# Altium schematic sheet EFUSE_TPS259460A.SchDoc
size A3
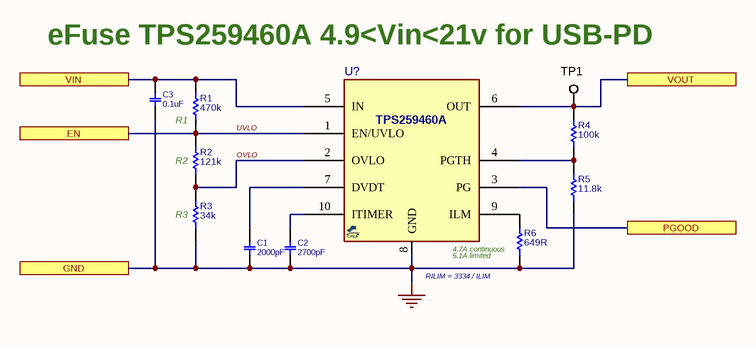
[diagram p0: EFUSE_TPS259460A.SchDoc]

## Parts
C1  2000pF  [C0402]
C2  2700pF  [C0402]
C3  0.1uF  [C0402]
R1  470k  [R0402]
R2  121k  [R0402]
R3  34k  [R0402]
R4  100k  [R0402]
R5  11.8k  [R0402]
R6  649R  [R0402]
TP1  TESTPOINT_SMD  [TPSMD_S1]  (value not drawn)  (no BOM)
U?  TPS259460A  [QFN45_10_2020_RPW]  (value not drawn)

## Ports
EN, GND, PGOOD, VIN, VOUT

## Nets
GND: C1.1 C2.1 C3.1 R3.1 R5.1 R6.1 U?.8(GND) ; port GND
OVLO: R2.1 R3.2 U?.2(OVLO)
PGOOD: U?.3(PG) ; port PGOOD
UVLO: R1.1 R2.2 U?.1(EN/UVLO) ; port EN
VIN: C3.2 R1.2 U?.5(IN) ; port VIN
VOUT: R4.2 TP1.1 U?.6(OUT) ; port VOUT
NetC1_2: C1.2 U?.7(DVDT)
NetC2_2: C2.2 U?.10(ITIMER)
NetR4_1: R4.1 R5.2 U?.4(PGTH)
NetR6_2: R6.2 U?.9(ILM)

## Notes on the sheet
- eFuse TPS259460A 4.9<Vin<21v for USB-PD
- (near R2) R2
- (near R1) R1
- (near R3) R3
- RILIM = 3334 / ILIM
- (near U?) 4.7A continuous
- (near U?) 5.1A limited

## Library data of the parts
C1-C3 = CAP_SMD_MLCC: CAP, MLCC; PARAM: X7R, 10%, -55~125oC; MANF_P#: GRM155R71H104KE14D; MANF: Murata; PARAM2: 50v; PRICE: 100: 0.018$; ASSEMBLY: ASSEMBLY
  C1: VALUE: 2000pF
  C2: VALUE: 2700pF
  C3: VALUE: 0.1uF
R1-R6 = RES_SMD: RESISTOR, SMD; PARAM: 0.063W; DESC: DESCRIPTION; DIST#: MOUSER; PARAM2: 1%; MANF_P#: -; MANF: -; ASSEMBLY: ASSEMBLY; PRICE: 100= 0.3$
  R1: VALUE: 470k
  R2: VALUE: 121k
  R3: VALUE: 34k
  R4: VALUE: 100k
  R5: VALUE: 11.8k
  R6: VALUE: 649R
TP1 = TESTPOINT_SMD: TEST POINT; MANF: MANF; MANF_P#: MANF_P#; VALUE: VALUE
U? = TPS259460A_QFN10: LOAD SW, 2.7~23V eFuse, 0.5~6A, 28mOhm, OVP+UVLO, autoretry; MANF: TI; MANF_P#: TPS259460ARPW; PARAM2: 2.7~23V, OVP, autoretry; PARAM: 0.5~6A, 28mOhm; PRICE: 1$; VALUE: TPS259460A